# EAGLE design breakout-enc424j600 (EAGLE 9.6.2)
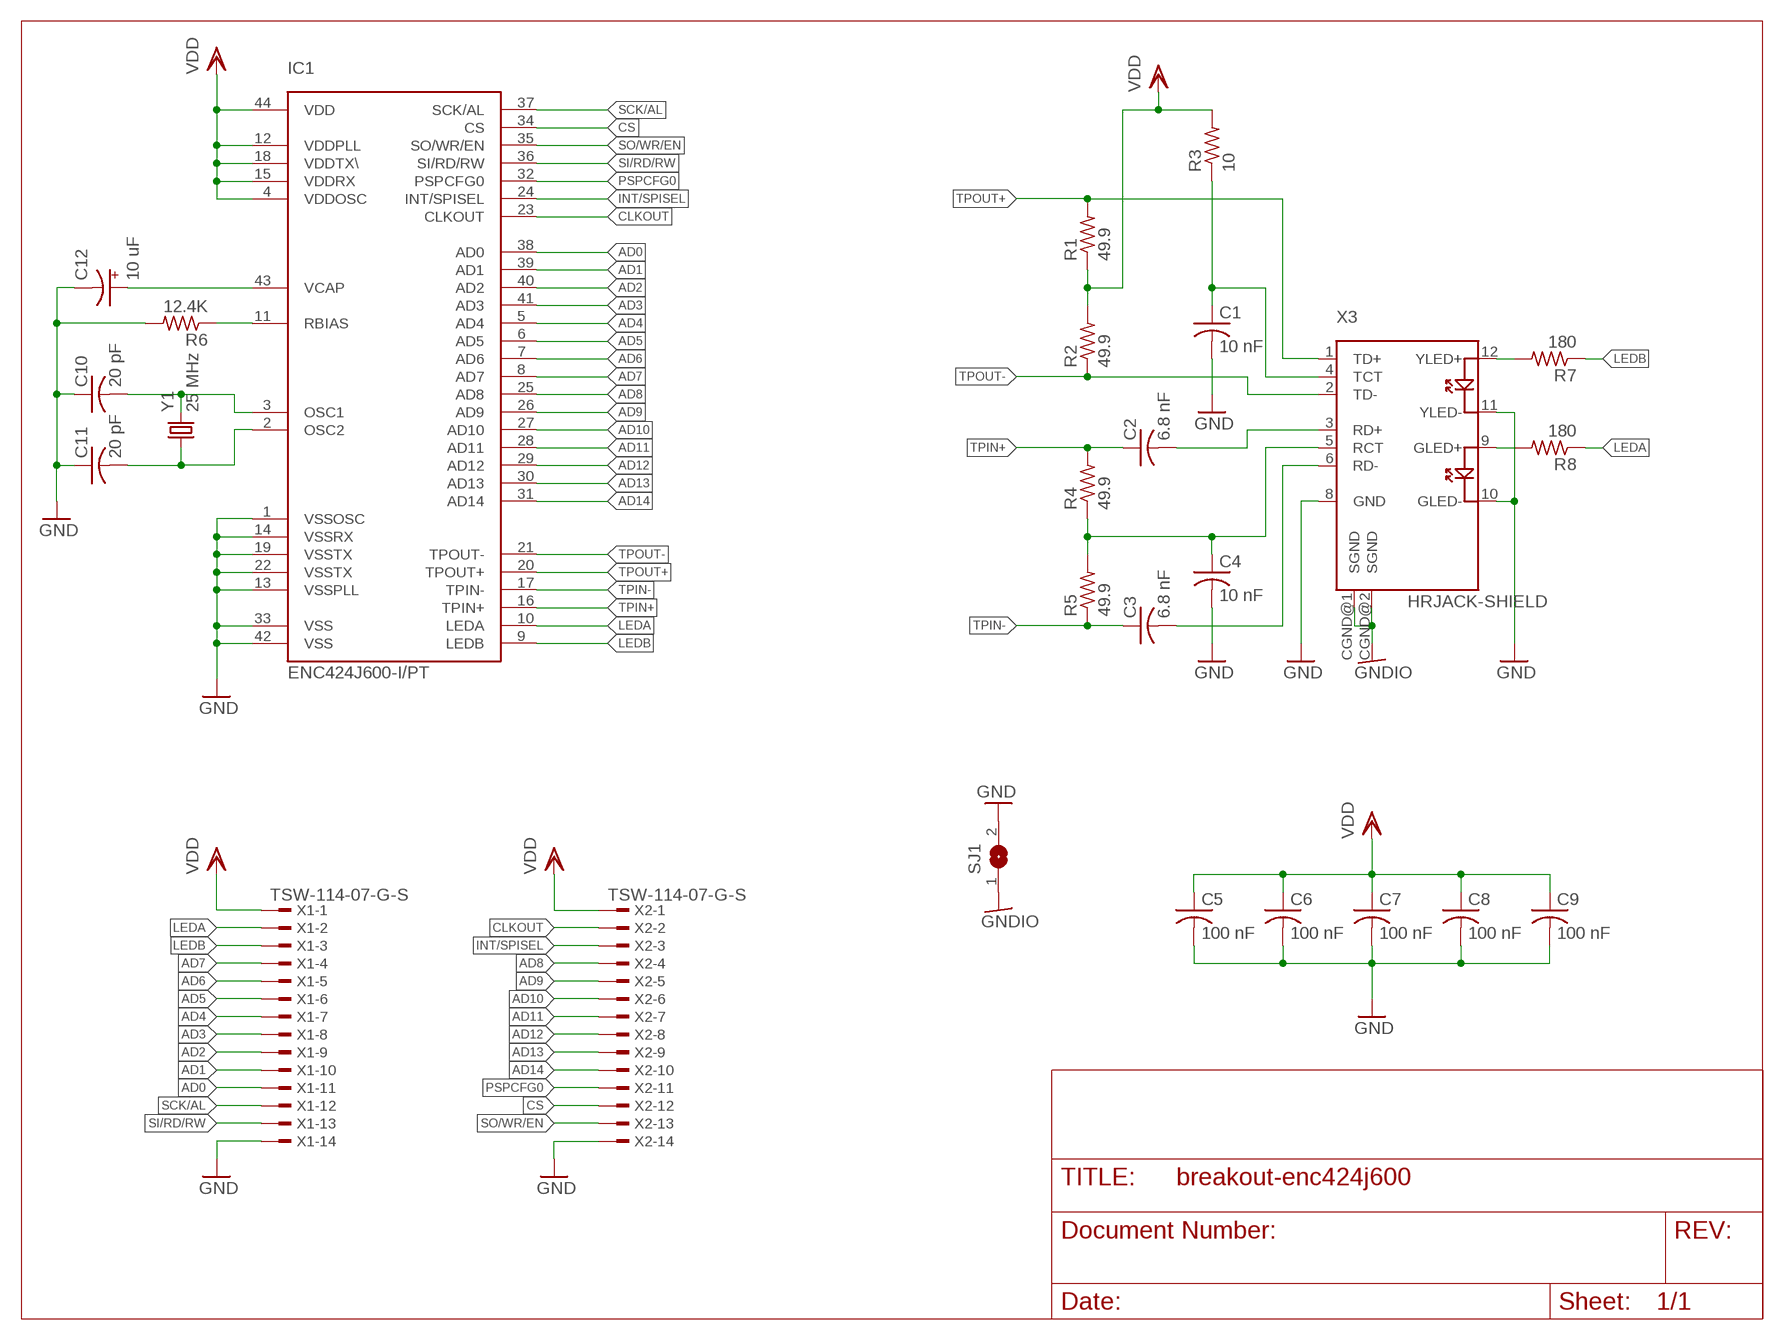
[diagram p0: schematic, sheet 1]

## Parts
C1  10 nF  C-USC0805  [C0805]
C2  6.8 nF  C-USC0805  [C0805]
C3  6.8 nF  C-USC0805  [C0805]
C4  10 nF  C-USC0805  [C0805]
C5  100 nF  C-USC0805  [C0805]
C6  100 nF  C-USC0805  [C0805]
C7  100 nF  C-USC0805  [C0805]
C8  100 nF  C-USC0805  [C0805]
C9  100 nF  C-USC0805  [C0805]
C10  20 pF  C-USC0805  [C0805]
C11  20 pF  C-USC0805  [C0805]
C12  10 uF  CPOL-USSMCA  [SMC_A]
IC1  ENC424J600-I/PT  [TQFP44]
R1  49.9  R-US_R0805  [R0805]
R2  49.9  R-US_R0805  [R0805]
R3  10  R-US_R0805  [R0805]
R4  49.9  R-US_R0805  [R0805]
R5  49.9  R-US_R0805  [R0805]
R6  12.4K  R-US_R0805  [R0805]
R7  180  R-US_R0805  [R0805]
R8  180  R-US_R0805  [R0805]
SJ1  SJW  [SJW]
X1  TSW-114-07-G-S  [TSW-114-XX-G-S]
X2  TSW-114-07-G-S  [TSW-114-XX-G-S]
X3  HRJACK-SHIELD  [HR911105A]
Y1  25 MHz  CRYSTALHC49UP  [HC49UP]

## Nets
AD0: IC1.38(AD0) X1.11
AD1: IC1.39(AD1) X1.10
AD2: IC1.40(AD2) X1.9
AD3: IC1.41(AD3) X1.8
AD4: IC1.5(AD4) X1.7
AD5: IC1.6(AD5) X1.6
AD6: IC1.7(AD6) X1.5
AD7: IC1.8(AD7) X1.4
AD8: IC1.25(AD8) X2.4
AD9: IC1.26(AD9) X2.5
AD10: IC1.27(AD10) X2.6
AD11: IC1.28(AD11) X2.7
AD12: IC1.29(AD12) X2.8
AD13: IC1.30(AD13) X2.9
AD14: IC1.31(AD14) X2.10
CLKOUT: IC1.23(CLKOUT) X2.2
CS: IC1.34(CS) X2.12
GND: C1.2 C4.2 C5.2 C6.2 C7.2 C8.2 C9.2 C10.1 C11.1 C12.- IC1.1(VSSOSC) IC1.13(VSSPLL) IC1.14(VSSRX) IC1.19(VSSTX) IC1.22(VSSTX) IC1.33(VSS) IC1.42(VSS) R6.2 SJ1.2 X1.14 X2.14 X3.8(GND) X3.10(GLED-) X3.11(YLED-)
GNDIO: SJ1.1 X3.CGND@1(SGND) X3.CGND@2(SGND)
INT/SPISEL: IC1.24(INT/SPISEL) X2.3
LEDA: IC1.10(LEDA) R8.1 X1.2
LEDB: IC1.9(LEDB) R7.1 X1.3
N$1: C11.2 IC1.2(OSC2) Y1.1
N$2: C1.1 R3.1 X3.4(TCT)
N$3: C10.2 IC1.3(OSC1) Y1.2
N$4: C2.2 X3.3(RD+)
N$5: C3.2 X3.6(RD-)
N$6: C4.1 R4.1 R5.2 X3.5(RCT)
N$7: IC1.11(RBIAS) R6.1
N$8: R8.2 X3.9(GLED+)
N$9: R7.2 X3.12(YLED+)
N$10: C12.+ IC1.43(VCAP)
PSPCFG0: IC1.32(PSPCFG0) X2.11
SCK/AL: IC1.37(SCK/AL) X1.12
SI/RD/RW: IC1.36(SI/RD/RW) X1.13
SO/WR/EN: IC1.35(SO/WR/EN) X2.13
TPIN+: C2.1 IC1.16(TPIN+) R4.2
TPIN-: C3.1 IC1.17(TPIN-) R5.1
TPOUT+: IC1.20(TPOUT+) R1.2 X3.1(TD+)
TPOUT-: IC1.21(TPOUT-) R2.1 X3.2(TD-)
VDD: C5.1 C6.1 C7.1 C8.1 C9.1 IC1.4(VDDOSC) IC1.12(VDDPLL) IC1.15(VDDRX) IC1.18(VDDTX\) IC1.44(VDD) R1.1 R2.2 R3.2 X1.1 X2.1

## Library data of the parts
C1-C11 = rcl:C-US: CAPACITOR, American symbol
C12 = rcl:CPOL-US: POLARIZED CAPACITOR, American symbol
IC1 = microchip-ethernet:ENC424J600: Stand-Alone 10/100 Ethernet Controller with SPI or Parallel Interface The ENC424J600 and ENC624J600 are stand-alone,Fast Ethernet controllers with an industry standard Serial Peripheral Interface (SPI) or a flexible parallel interface. They are designed to serve as an Ethernet network interface for any microcontroller equipped with SPI or a standard parallel port. ENC424J600/624J600 devices meet all of the IEEE 802.3 specifications applicable to 10Base-T and 100Base-TX Ethernet, including many optional clauses, such as auto-negotiation. They incorporate a number of packet filtering schemes to limit incoming packets. They also provide an internal, 16-bit wide DMA for fast data throughput and support for hardware IP checksum calculations. For applications that require the security and authentication features of SSL, TLS and other protocols related to cryptography, a block of security engines is provided. The engines perform RSA, Diffie-Hellman, AES, MD5 and SHA-1 algorithm computations, allowing reduced code size, faster connection establishment and throughput, and reduced firmware development effort.
R1-R8 = rcl:R-US_: RESISTOR, American symbol
SJ1 = jumper:SJ: SMD solder JUMPER
X1 X2 = con-samtec:TSW-114-*-G-S: THROUGH-HOLE .025" SQ POST HEADER Source: Samtec TSW.pdf; MF: Samtec Inc.; MPN: TSW-114-07-G-S
X3 = various-electromechanical:HRJACK-SHIELD
Y1 = crystal:CRYSTAL: CRYSTAL

## Board
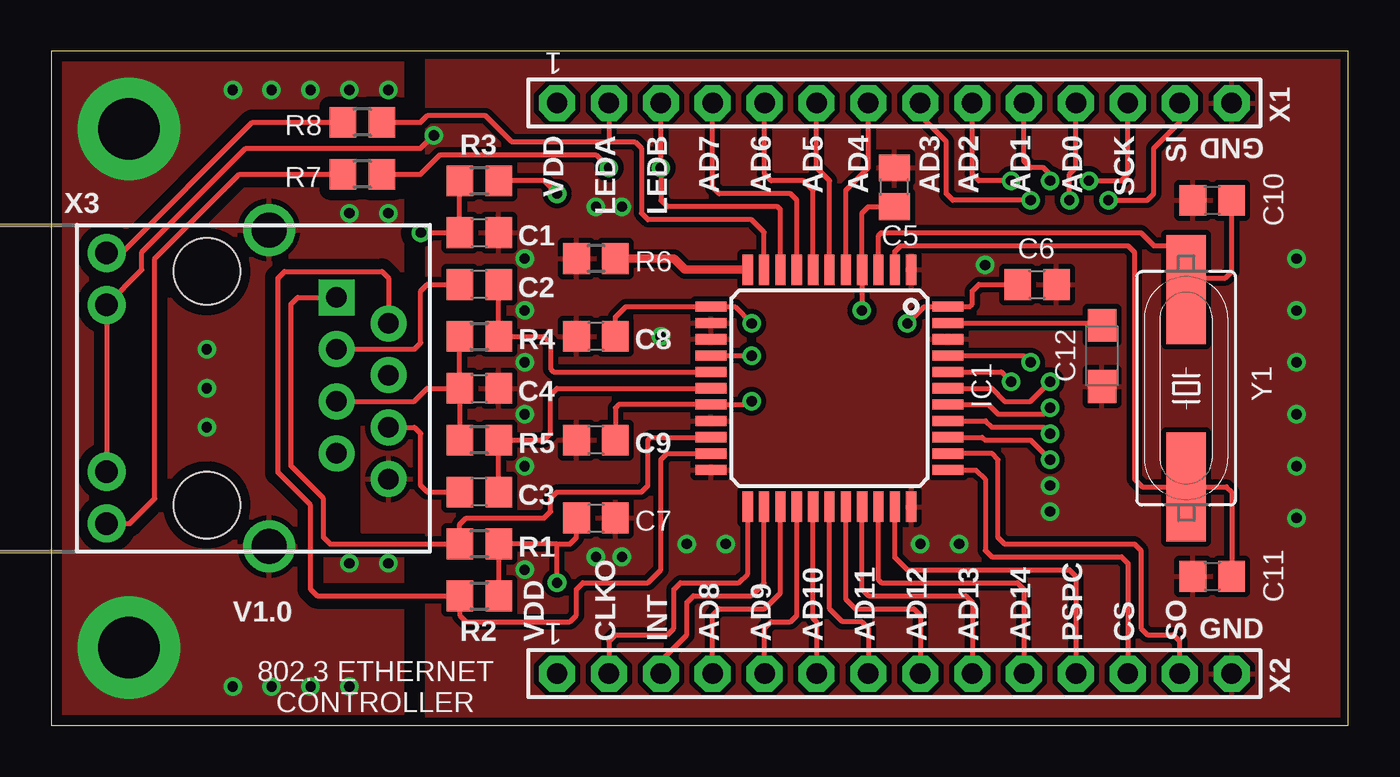
[diagram p1: board, top side]
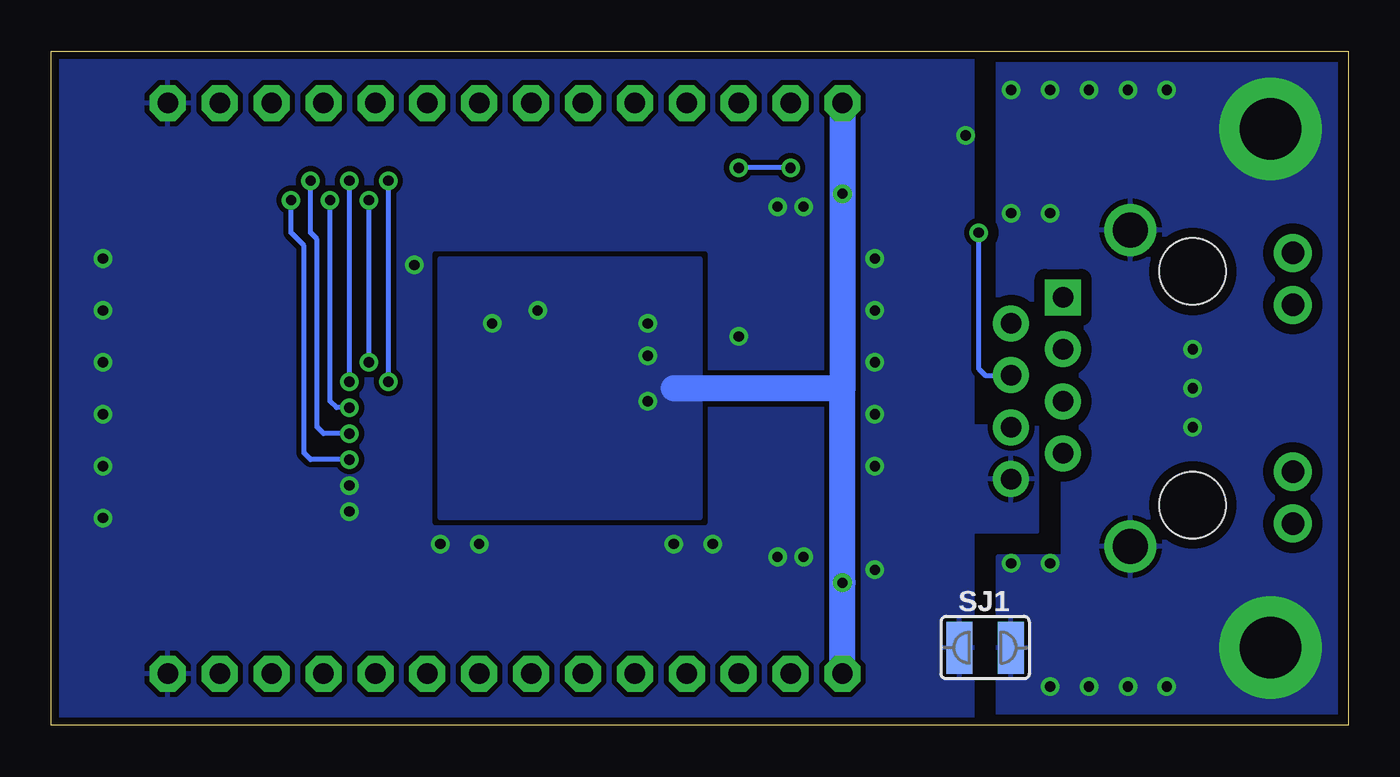
[diagram p2: board, bottom side, seen from below]

Size 63.5 x 33.02 mm. Coordinates in mm from the lower left corner, seen from the top.
Outline: 0,33.02 0,0.02 63.5,0 63.5,33.02 0,33.02
Copper layers (1*16): Top 0.035mm / dielectric 1.5mm / Bottom 0.035mm
Design rules "default *": minimum track width 10mil, minimum drill 0.5mm, track to track 10mil, track to pad 10mil, pad to pad 10mil, via to via 10mil, smd to smd 10mil, copper to edge 15mil, drill to drill 8mil, minimum pad ring 15mil, minimum via ring 8mil, stop-mask expansion 4mil, vias tented up to drill 20mil, thermal gap 10mil

### Footprints (pad centres in the part's own frame; a part is rotated, then mirrored left to right if it is on the bottom)
C0805 = smd 1.3 x 1.5: 1 -0.95,0; 2 0.95,0
SMC_A = smd 1.6 x 1.4: + -1.5,0; - 1.5,0
TQFP44 = smd 1.5 x 0.5: 1 -5.8,4; 2 -5.8,3.2; 3 -5.8,2.4; 4 -5.8,1.6; 5 -5.8,0.8; 6 -5.8,0; 7 -5.8,-0.8; 8 -5.8,-1.6; 9 -5.8,-2.4; 10 -5.8,-3.2; 11 -5.8,-4; 23 5.8,-4; 24 5.8,-3.2; 25 5.8,-2.4; 26 5.8,-1.6; 27 5.8,-0.8; 28 5.8,0; 29 5.8,0.8; 30 5.8,1.6; 31 5.8,2.4; 32 5.8,3.2; 33 5.8,4 | smd 0.5 x 1.5: 12 -4,-5.8; 13 -3.2,-5.8; 14 -2.4,-5.8; 15 -1.6,-5.8; 16 -0.8,-5.8; 17 0,-5.8; 18 0.8,-5.8; 19 1.6,-5.8; 20 2.4,-5.8; 21 3.2,-5.8; 22 4,-5.8; 34 4,5.8; 35 3.2,5.8; 36 2.4,5.8; 37 1.6,5.8; 38 0.8,5.8; 39 0,5.8; 40 -0.8,5.8; 41 -1.6,5.8; 42 -2.4,5.8; 43 -3.2,5.8; 44 -4,5.8
R0805 = smd 1.3 x 1.5: 1 -0.95,0; 2 0.95,0
SJW = smd 1.27 x 2.54: 1 -1.27,0; 2 1.27,0
TSW-114-XX-G-S = drill 1 pad 1.5 octagon: 1 16.51,0; 2 13.97,0; 3 11.43,0; 4 8.89,0; 5 6.35,0; 6 3.81,0; 7 1.27,0; 8 -1.27,0; 9 -3.81,0; 10 -6.35,0; 11 -8.89,0; 12 -11.43,0; 13 -13.97,0; 14 -16.51,0
HR911105A = drill 1 square: 1 4.45,-6.35 | drill 1: 2 3.18,-8.89; 3 1.91,-6.35; 4 0.64,-8.89; 5 -0.64,-6.35; 6 -1.91,-8.89; 7 -3.18,-6.35; 8 -4.45,-8.89 | drill 1.1: 9 6.625,4.9; 10 4.085,4.9; 11 -4.085,4.9; 12 -6.625,4.9 | drill 1.7: CGND@1 -7.745,-3.05; CGND@2 7.745,-3.05 | hole 3.25: 5.715,0; -5.715,0
HC49UP = smd 5.334 x 1.93: 1 -4.826,0; 2 4.826,0

### Placement (x,y rotation side)
C1  20.95,24.13 0 top
C2  20.95,21.59 180 top
C3  20.95,11.43 180 top
C4  20.95,16.51 0 top
C5  41.27,26.35 90 top
C6  48.26,21.59 0 top
C7  26.67,10.16 0 top
C8  26.67,19.05 180 top
C9  26.67,13.97 180 top
C10  56.83,25.72 0 top
C11  56.83,7.3 0 top
C12  51.44,18.1 270 top
IC1  38.1,16.51 270 top
R1  20.95,8.89 180 top
R2  20.95,6.35 0 top
R3  20.95,26.67 0 top
R4  20.95,19.05 0 top
R5  20.95,13.97 180 top
R6  26.67,22.86 180 top
R7  15.24,26.99 180 top
R8  15.24,29.53 180 top
SJ1  17.78,3.81 180 bottom
X1  41.27,30.48 180 top
X2  41.27,2.54 180 top
X3  7.62,16.51 90 top
Y1  55.56,16.51 90 top

### Tracks (layer width: path | path; a pad name or v marks a point on that pad's centre or on a via)
AD0  (via drill 0.5)
  Top 0.254: IC1.38 45.88,15.71 46.35,15.24 48.58,15.24 v48.9,15.56 | v49.85,25.72 49.85,26.99 50.16,27.3 X1.11
  Bottom 0.254: v48.9,15.56 49.53,15.56 49.85,15.88 v49.85,25.72
AD1  (via drill 0.5)
  Top 0.254: IC1.39 46.04,16.51 46.67,15.88 47.94,15.88 v48.9,16.83 | v48.9,26.67 48.9,26.99 48.58,27.3 47.94,27.3 47.62,27.62 X1.10
  Bottom 0.254: v48.9,16.83 v48.9,26.67
AD2  (via drill 0.5)
  Top 0.254: IC1.40 46.51,17.31 v46.99,16.83 | v46.99,26.67 45.4,26.67 45.09,26.99 X1.9
  Bottom 0.254: v46.99,16.83 v46.99,26.67
AD3  (via drill 0.5)
  Top 0.254: IC1.41 47.61,18.11 v47.94,17.78 | v47.94,25.72 44.13,25.72 43.81,26.04 43.81,28.57 42.55,29.84 X1.8
  Bottom 0.254: v47.94,17.78 v47.94,25.72
AD4
  Top 0.254: IC1.5 38.9,26.2 40.01,27.3 X1.7
AD5
  Top 0.254: IC1.6 38.1,26.67 37.47,27.3 X1.6
AD6
  Top 0.254: IC1.7 37.3,26.2 36.83,26.67 35.24,26.67 34.92,26.99 X1.5
AD7
  Top 0.254: IC1.8 36.5,25.73 36.2,26.04 32.7,26.04 32.38,26.35 X1.4
AD8
  Top 0.254: IC1.25 35.7,6.49 34.92,5.71 32.7,5.71 32.38,5.4 X2.4
AD9
  Top 0.254: IC1.26 36.5,5.38 36.2,5.08 35.24,5.08 34.92,4.76 X2.5
AD10
  Top 0.254: IC1.27 37.3,5.25 37.47,5.08 X2.6
AD11
  Top 0.254: IC1.28 38.1,5.71 38.73,5.08 39.69,5.08 40.01,4.76 X2.7
AD12
  Top 0.254: IC1.29 38.9,6.18 39.37,5.71 42.23,5.71 42.55,5.4 X2.8
AD13
  Top 0.254: IC1.30 39.7,6.66 40.01,6.35 44.77,6.35 45.09,6.03 X2.9
AD14
  Top 0.254: IC1.31 40.5,7.12 40.64,6.99 47.31,6.99 47.62,6.67 X2.10
CLKOUT
  Top 0.254: IC1.23 34.1,7.43 33.66,6.99 30.8,6.99 30.48,6.67 30.48,4.76 30.16,4.45 27.62,4.45 27.3,4.13 X2.2
CS
  Top 0.254: IC1.34 45.27,12.51 45.72,12.06 45.72,8.57 46.04,8.26 52.39,8.26 52.7,7.94 X2.12
GND  (via drill 0.5)
  Top 0.254: X3.11 X3.10 4.45,22.32 4.45,23.18 9.53,28.26 18.1,28.26 v18.73,28.89
  other vias: 23.18,15.24 23.18,17.78 45.72,22.54 48.9,11.75 48.9,10.48 33.02,8.89 31.11,8.89 26.67,8.26 27.94,8.26 23.18,12.7 29.84,19.05 26.67,25.4 27.94,25.4 42.55,8.89 44.45,8.89 23.18,20.32 23.18,22.86 23.18,7.62 60.96,22.86 60.96,20.32 60.96,17.78 60.96,15.24 60.96,12.7 60.96,10.16
  pour Bottom (isolate 0.254, rank 2): 63.5,33.02 63.5,0 18.41,0 18.41,9.53 15.24,9.53 15.24,14.61 18.41,14.61 18.41,33.02
  pour Top: 18.41,33.02 18.41,14.61 15.24,14.61 15.24,9.53 18.41,9.53 18.41,0 63.5,0 63.5,33.02
GNDIO  (via drill 0.5, 3 pad 5)
  other vias: 8.89,31.11 10.79,31.11 12.7,31.11 14.61,31.11 16.51,31.11 8.89,1.91 12.7,1.91 10.79,1.91 14.61,1.91 7.62,18.41 7.62,16.51 7.62,14.61 14.61,25.08 16.51,25.08 3.81,29.21 3.81,3.81 14.61,7.94 16.51,7.94
  pour Top (isolate 0.508): 17.14,33.02 17.14,17.14 13.97,17.14 13.97,8.26 17.14,8.26 17.14,0 0,0 0,33.02
  pour Bottom (isolate 0.508): 0,0 0,33.02 17.14,33.02 17.14,17.14 13.97,17.14 13.97,8.26 17.14,8.26 17.14,0
INT/SPISEL
  Top 0.254: IC1.24 34.9,6.96 34.29,6.35 31.43,6.35 31.11,6.03 31.11,4.45 29.84,3.17 X2.3
LEDA
  Top 0.254: R8.1 18.09,29.53 18.41,29.84 21.27,29.84 22.54,28.57 27.3,28.57 | 27.3,28.57 28.57,28.57 28.89,28.26 28.89,25.08 29.21,24.77 34.29,24.77 34.9,24.16 IC1.10 | X1.2 27.3,28.57
LEDB  (via drill 0.5)
  Top 0.254: R7.1 18.1,26.99 19.05,27.94 26.67,27.94 v27.3,27.3 | IC1.9 35.7,25.26 35.56,25.4 30.16,25.4 29.84,25.72 v29.84,27.3 X1.3
  Bottom 0.254: v27.3,27.3 v29.84,27.3
N$1
  Top 0.254: IC1.2 41.3,23.2 41.59,23.5 52.7,23.5 53.02,23.18 53.02,12.06 53.4,11.68 Y1.1 57.53,11.68 57.78,11.43 C11.2
N$2  (via drill 0.5)
  Top 0.254: v18.1,24.13 C1.1 R3.1
  Bottom 0.254: v18.1,24.13 18.1,17.46 17.78,17.14 X3.4
N$3
  Top 0.254: IC1.3 40.5,23.99 40.64,24.13 53.34,24.13 53.98,23.5 55.24,23.5 55.24,21.97 55.31,21.91 | 55.31,21.91 Y1.2 | 55.31,21.91 57.47,21.91 57.78,22.23 C10.2
N$4
  Top 0.254: C2.2 18.41,21.59 18.1,21.27 18.1,18.73 17.79,18.42 X3.3
N$5
  Top 0.254: C3.2 18.41,11.43 18.1,11.75 18.1,14.29 17.79,14.6 X3.6
N$6
  Top 0.254: C4.1 R4.1 | C4.1 R5.2 | C4.1 18.41,16.51 17.77,15.87 X3.5
N$7
  Top 0.406: IC1.11 31.03,22.31 30.48,22.86 R6.1
N$8
  Top 0.254: R8.2 9.84,29.53 3.45,23.14 X3.9
N$9
  Top 0.254: R7.2 9.21,26.99 5.08,22.86 5.08,11.11 3.85,9.88 X3.12
N$10
  Top 0.254: IC1.43 51.32,19.71 C12.+
PSPCFG0
  Top 0.254: IC1.32 41.3,8.23 41.91,7.62 49.85,7.62 50.16,7.3 X2.11
SCK/AL  (via drill 0.5)
  Top 0.254: IC1.37 45.73,14.91 46.04,14.61 48.58,14.61 v48.9,14.29 | v50.8,26.67 52.39,26.67 52.7,26.99 X1.12
  Bottom 0.254: v50.8,26.67 50.8,24.13 50.48,23.81 50.48,14.61 50.16,14.29 v48.9,14.29
SI/RD/RW  (via drill 0.5)
  Top 0.254: IC1.36 45.58,14.11 45.72,13.97 47.94,13.97 v48.9,13.02 | v51.75,25.72 53.66,25.72 53.98,26.04 53.98,28.26 55.24,29.53 X1.13
  Bottom 0.254: v51.75,25.72 51.75,24.13 51.12,23.5 51.12,13.34 50.8,13.02 v48.9,13.02
SO/WR/EN
  Top 0.254: IC1.35 46.06,13.31 46.35,13.02 46.35,9.21 46.67,8.89 53.02,8.89 53.34,8.57 53.34,4.76 53.66,4.45 54.93,4.45 55.24,4.13 X2.13
TPIN+
  Top 0.254: C2.1 R4.2 24.13,19.05 24.45,18.73 24.45,17.46 24.6,17.31 IC1.16
TPIN-
  Top 0.254: C3.1 R5.1 24.13,13.97 24.45,14.29 24.45,16.19 24.77,16.51 IC1.17
TPOUT+
  Top 0.254: IC1.20 29.35,14.11 29.21,13.97 29.21,11.75 28.89,11.43 24.77,11.43 24.45,11.11 24.45,10.48 24.13,10.16 20.32,10.16 20,9.85 R1.2 13.65,8.89 13.34,9.21 13.34,11.11 11.75,12.7 11.75,20.64 12.07,20.96 X3.1
TPOUT-
  Top 0.254: IC1.21 30.14,13.31 29.84,13.02 29.84,7.62 29.21,6.99 26.04,6.99 25.72,6.67 25.72,5.4 25.4,5.08 20.32,5.08 20,5.39 R2.1 13.02,6.35 12.7,6.67 12.7,10.79 11.11,12.38 11.11,21.91 11.43,22.23 16.19,22.23 16.51,21.91 X3.2
VDD  (via drill 0.5)
  Top 0.254: R2.2 R1.1 24.77,8.89 | C8.1 27.62,20 28.13,20.51 IC1.12 33.47,20.51 v34.29,19.68 | 24.77,8.89 25.4,8.89 25.72,9.21 C7.1 | IC1.15 34.28,18.11 v34.29,18.1 | C5.1 40.01,25.4 39.7,25.09 IC1.4 39.69,22.3 v39.69,20.32 | v41.91,19.68 42.73,20.51 IC1.44 44.96,20.51 45.09,20.64 45.09,21.27 45.4,21.59 C6.1 | v24.77,6.99 24.77,8.89 | R3.2 24.13,26.67 v24.77,26.04 | v34.29,15.88 34.12,15.71 IC1.18 27.77,15.71 27.62,15.56 C9.1
  Bottom 1.27: 24.77,16.51 v24.77,26.04 X1.1 | 24.77,16.51 33.02,16.51 | 24.77,16.51 v24.77,6.99 X2.1
  pour Bottom (isolate 0.305): 44.45,10.16 44.45,22.86 31.75,22.86 31.75,10.16

### Text on the board
tNames: VDD | LEDA | LEDB | AD7 | AD6 | AD5 | AD4 | AD3 | AD2 | AD1 | AD0 | SCK | SI | GND | V1.0 | GND | VDD | CLKO | INT | AD8 | AD9 | AD10 | AD11 | AD12 | AD13 | AD14 | PSPC | CS | SO | 802.3 ETHERNET / CONTROLLER